# Altium schematic sheet Sheet1.SchDoc
size A2
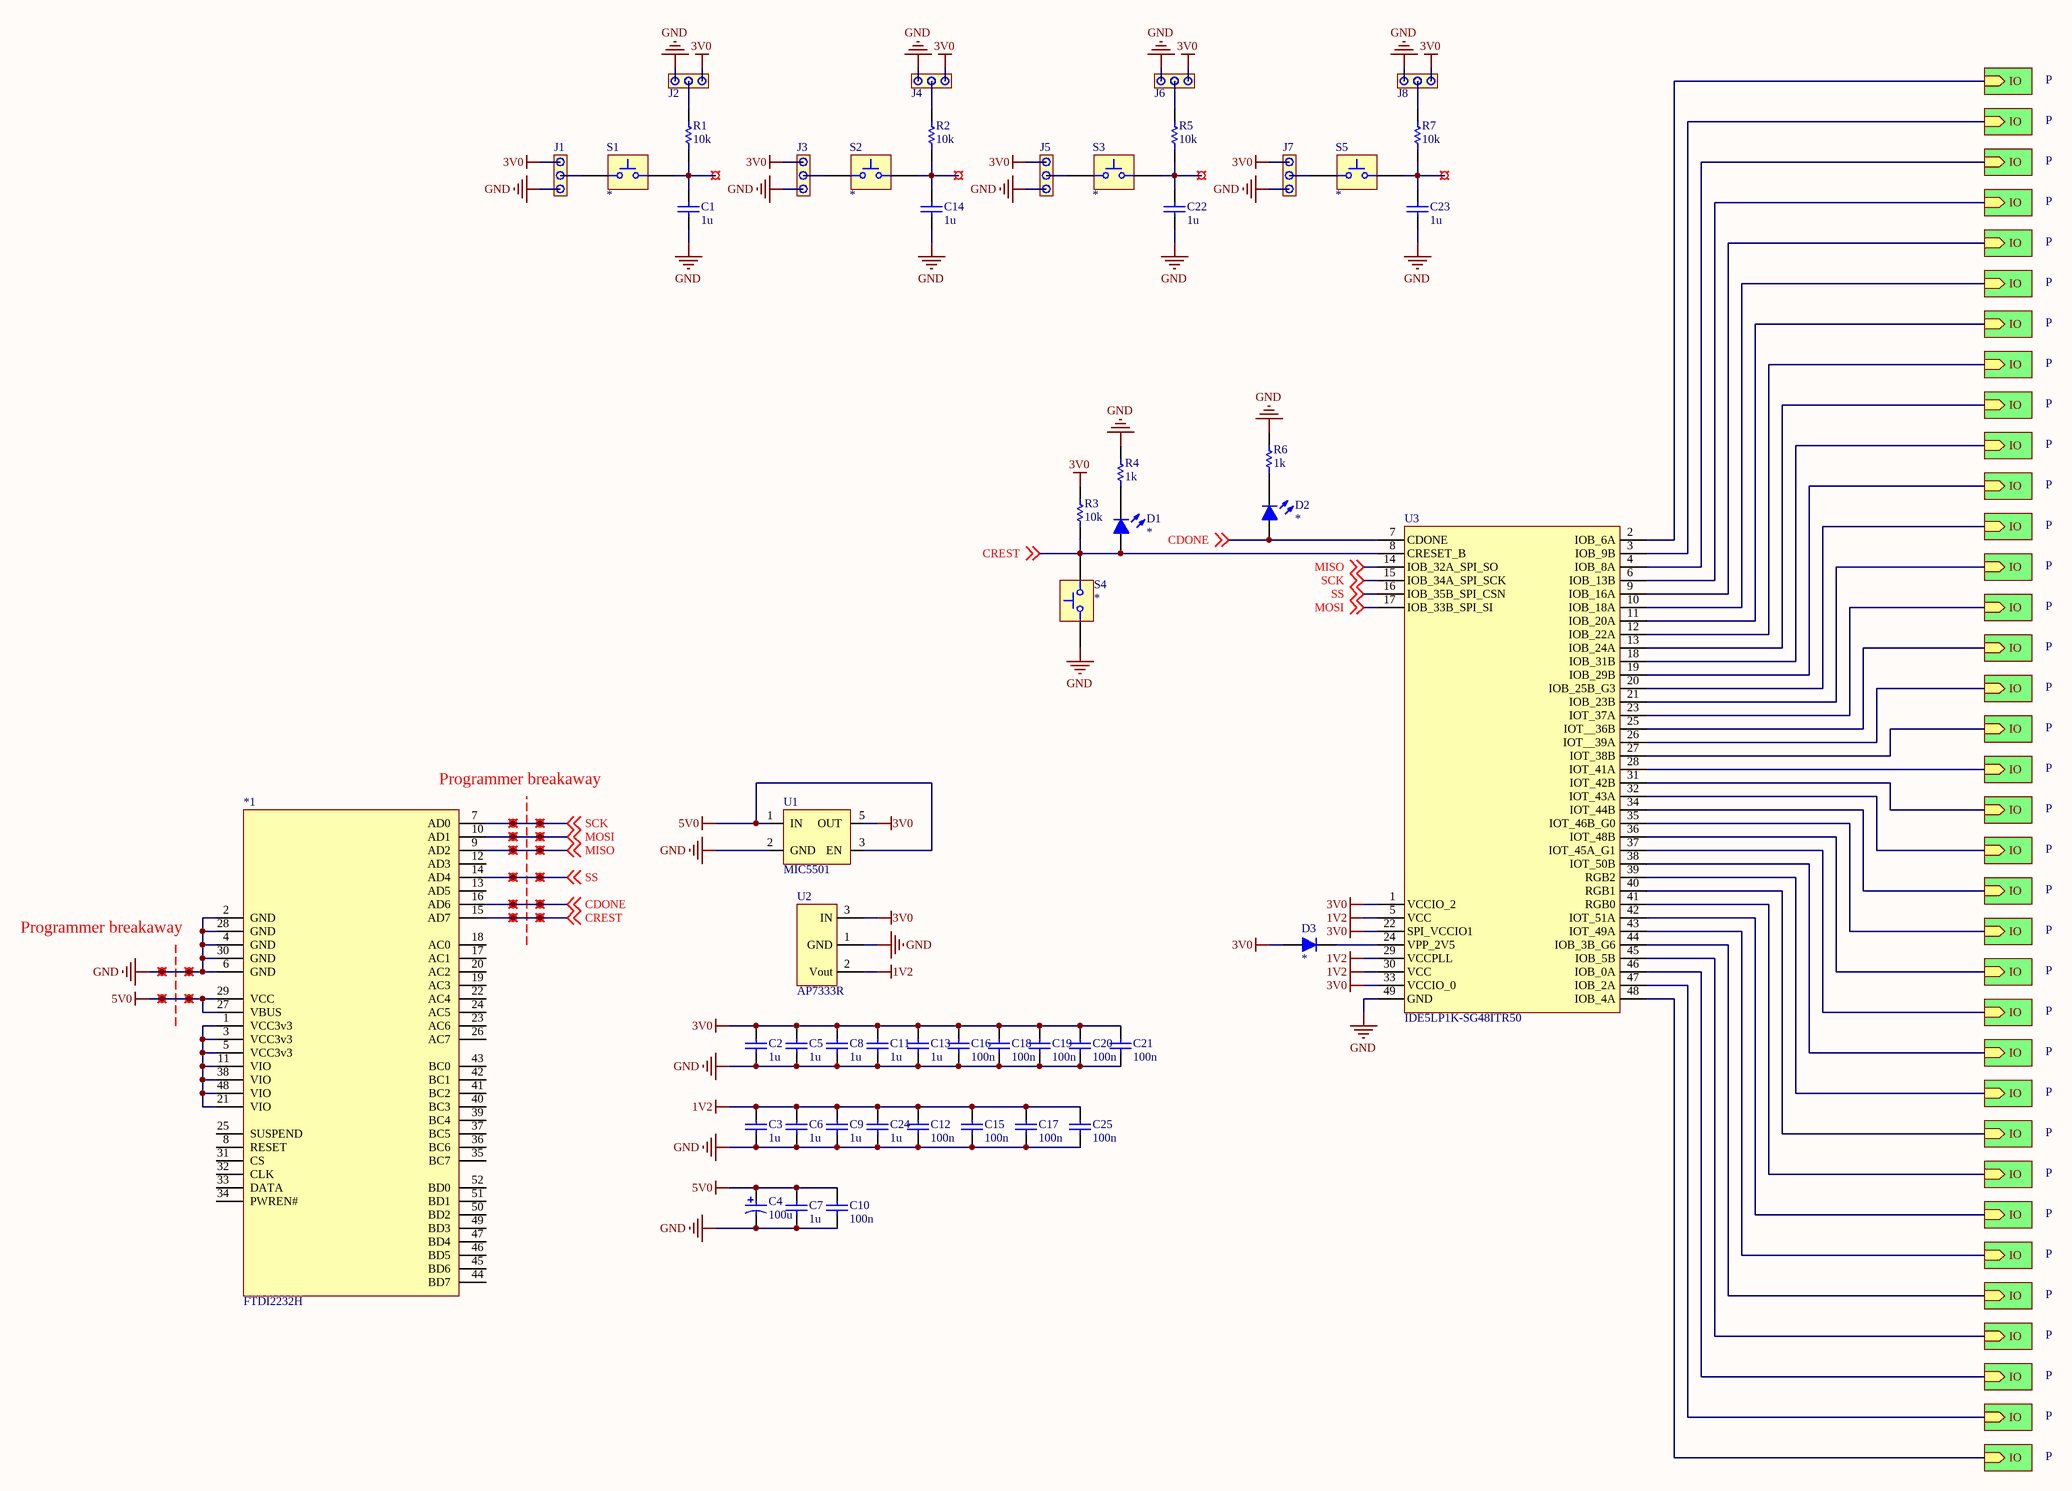
[diagram p0: Sheet1.SchDoc]

## Parts
*  Logo  [ALogo]  (value not drawn)
*1  FTDI2232H  [FTDI2232H]
C1  1u  [CAP 0805_N]
C2  1u  [CAP 0805_N]
C3  1u  [CAP 0805_N]
C4  100u  [SMD CAP-6.3X7.7MM-A1K2]
C5  1u  [CAP 0805_N]
C6  1u  [CAP 0805_N]
C7  1u  [CAP 0805_N]
C8  1u  [CAP 0805_N]
C9  1u  [CAP 0805_N]
C10  100n  [CAP 0603_N]
C11  1u  [CAP 0805_N]
C12  100n  [CAP 0603_N]
C13  1u  [CAP 0805_N]
C14  1u  [CAP 0805_N]
C15  100n  [CAP 0603_N]
C16  100n  [CAP 0603_N]
C17  100n  [CAP 0603_N]
C18  100n  [CAP 0603_N]
C19  100n  [CAP 0603_N]
C20  100n  [CAP 0603_N]
C21  100n  [CAP 0603_N]
C22  1u  [CAP 0805_N]
C23  1u  [CAP 0805_N]
C24  1u  [CAP 0805_N]
C25  100n  [CAP 0603_N]
D1  (no value)  [LED-0603-K1A2]
D2  (no value)  [LED-0603-K1A2]
D3  *  [SMA_L-K1A2]
J1  (no value)  [HDR1X3 VERT]
J2  (no value)  [HDR1X3 VERT]
J3  (no value)  [HDR1X3 VERT]
J4  (no value)  [HDR1X3 VERT]
J5  (no value)  [HDR1X3 VERT]
J6  (no value)  [HDR1X3 VERT]
J7  (no value)  [HDR1X3 VERT]
J8  (no value)  [HDR1X3 VERT]
R1  value 10k  [RES 0603_N]  (hidden comment: Res)
R2  value 10k  [RES 0603_N]  (hidden comment: Res)
R3  value 10k  [RES 0603_N]  (hidden comment: Res)
R4  value 1k  [RES 0603_N]  (hidden comment: Res)
R5  value 10k  [RES 0603_N]  (hidden comment: Res)
R6  value 1k  [RES 0603_N]  (hidden comment: Res)
R7  value 10k  [RES 0603_N]  (hidden comment: Res)
S1  SW Tactile  [SW-TACT-SMD-6035]  (value not drawn)
S2  SW Tactile  [SW-TACT-SMD-6035]  (value not drawn)
S3  SW Tactile  [SW-TACT-SMD-6035]  (value not drawn)
S4  SW Tactile  [SW-TACT-SMD-6035]  (value not drawn)
S5  SW Tactile  [SW-TACT-SMD-6035]  (value not drawn)
TP1  (no value)  [THTP]
TP2  (no value)  [THTP]
TP3  (no value)  [THTP]
TP4  (no value)  [THTP]
TP5  (no value)  [THTP]
TP6  (no value)  [THTP]
TP7  (no value)  [THTP]
TP8  (no value)  [THTP]
TP9  (no value)  [THTP]
TP10  (no value)  [THTP]
TP11  (no value)  [THTP]
TP12  (no value)  [THTP]
TP13  (no value)  [THTP]
TP14  (no value)  [THTP]
TP15  (no value)  [THTP]
TP16  (no value)  [THTP]
TP17  (no value)  [THTP]
TP26  (no value)  [THTP]
TP28  (no value)  [THTP]
TP30  (no value)  [THTP]
U1  MIC5501  [SOT23-5]
U2  AP7333R  [SOT95P245X110-3N]
U3  IDE5LP1K-SG48ITR50  [QFN50P700X700X85_HS-49M]

## Sub-sheets
P = IOpin.SchDoc: IO (in)
P = IOpin.SchDoc: IO (in)
P = IOpin.SchDoc: IO (in)
P = IOpin.SchDoc: IO (in)
P = IOpin.SchDoc: IO (in)
P = IOpin.SchDoc: IO (in)
P = IOpin.SchDoc: IO (in)
P = IOpin.SchDoc: IO (in)
P = IOpin.SchDoc: IO (in)
P = IOpin.SchDoc: IO (in)
P = IOpin.SchDoc: IO (in)
P = IOpin.SchDoc: IO (in)
P = IOpin.SchDoc: IO (in)
P = IOpin.SchDoc: IO (in)
P = IOpin.SchDoc: IO (in)
P = IOpin.SchDoc: IO (in)
P = IOpin.SchDoc: IO (in)
P = IOpin.SchDoc: IO (in)
P = IOpin.SchDoc: IO (in)
P = IOpin.SchDoc: IO (in)
P = IOpin.SchDoc: IO (in)
P = IOpin.SchDoc: IO (in)
P = IOpin.SchDoc: IO (in)
P = IOpin.SchDoc: IO (in)
P = IOpin.SchDoc: IO (in)
P = IOpin.SchDoc: IO (in)
P = IOpin.SchDoc: IO (in)
P = IOpin.SchDoc: IO (in)
P = IOpin.SchDoc: IO (in)
P = IOpin.SchDoc: IO (in)
P = IOpin.SchDoc: IO (in)
P = IOpin.SchDoc: IO (in)
P = IOpin.SchDoc: IO (in)
P = IOpin.SchDoc: IO (in)
P = IOpin.SchDoc: IO (in)

## Nets
1V2: C3.1 C6.1 C9.1 C12.1 C15.1 C17.1 C24.1 C25.1 U2.2(Vout) U3.5(VCC) U3.29(VCCPLL) U3.30(VCC)
3V0: C2.1 C5.1 C8.1 C11.1 C13.1 C16.1 C18.1 C19.1 C20.1 C21.1 D3.2(A) J1.3 J2.1 J3.3 J4.1 J5.3 J6.1 J7.3 J8.1 R3.2 U1.5(OUT) U2.3(IN) U3.1(VCCIO_2) U3.22(SPI_VCCIO1) U3.33(VCCIO_0)
5V0: *1.27(VBUS) *1.29(VCC) C4.1(A) C7.1 C10.1 TP2.1 TP4.1 U1.1(IN) U1.3(EN)
GND: *1.2(GND) *1.4(GND) *1.6(GND) *1.28(GND) *1.30(GND) C1.2 C2.2 C3.2 C4.2(K) C5.2 C6.2 C7.2 C8.2 C9.2 C10.2 C11.2 C12.2 C13.2 C14.2 C15.2 C16.2 C17.2 C18.2 C19.2 C20.2 C21.2 C22.2 C23.2 C24.2 C25.2 J1.1 J2.3 J3.1 J4.3 J5.1 J6.3 J7.1 J8.3 R4.1 R6.1 S4.1 TP1.1 TP3.1 U1.2(GND) U2.1(GND) U3.49(GND)
CDONE: *1.16(AD6) D2.2(A) TP9.1 TP15.1 U3.7(CDONE) ; off-sheet CDONE
CREST: *1.15(AD7) D1.2(A) R3.1 S4.2 TP10.1 TP16.1 U3.8(CRESET_B) ; off-sheet CREST
MISO: *1.9(AD2) TP7.1 TP13.1 U3.14(IOB_32A_SPI_SO) ; off-sheet MISO
MOSI: *1.10(AD1) TP6.1 TP12.1 U3.17(IOB_33B_SPI_SI) ; off-sheet MOSI
SCK: *1.7(AD0) TP5.1 TP11.1 U3.15(IOB_34A_SPI_SCK) ; off-sheet SCK
SS: *1.14(AD4) TP8.1 TP14.1 U3.16(IOB_35B_SPI_CSN) ; off-sheet SS
Net*1_1: *1.1(VCC3v3) *1.3(VCC3v3) *1.5(VCC3v3) *1.11(VIO) *1.21(VIO) *1.38(VIO) *1.48(VIO)
NetC1_1: C1.1 R1.1 S1.2 TP17.1
NetC14_1: C14.1 R2.1 S2.2 TP26.1
NetC22_1: C22.1 R5.1 S3.2 TP28.1
NetC23_1: C23.1 R7.1 S5.2 TP30.1
NetD1_1: D1.1(K) R4.2
NetD2_1: D2.1(K) R6.2
NetD3_1: D3.1(K) U3.24(VPP_2V5)
NetJ1_2: J1.2 S1.1
NetJ2_2: J2.2 R1.2
NetJ3_2: J3.2 S2.1
NetJ4_2: J4.2 R2.2
NetJ5_2: J5.2 S3.1
NetJ6_2: J6.2 R5.2
NetJ7_2: J7.2 S5.1
NetJ8_2: J8.2 R7.2
NetU3_2: U3.2(IOB_6A) ; sheet P/IO
NetU3_3: U3.3(IOB_9B) ; sheet P/IO
NetU3_4: U3.4(IOB_8A) ; sheet P/IO
NetU3_6: U3.6(IOB_13B) ; sheet P/IO
NetU3_9: U3.9(IOB_16A) ; sheet P/IO
NetU3_10: U3.10(IOB_18A) ; sheet P/IO
NetU3_11: U3.11(IOB_20A) ; sheet P/IO
NetU3_12: U3.12(IOB_22A) ; sheet P/IO
NetU3_13: U3.13(IOB_24A) ; sheet P/IO
NetU3_18: U3.18(IOB_31B) ; sheet P/IO
NetU3_19: U3.19(IOB_29B) ; sheet P/IO
NetU3_20: U3.20(IOB_25B_G3) ; sheet P/IO
NetU3_21: U3.21(IOB_23B) ; sheet P/IO
NetU3_23: U3.23(IOT_37A) ; sheet P/IO
NetU3_25: U3.25(IOT__36B) ; sheet P/IO
NetU3_26: U3.26(IOT__39A) ; sheet P/IO
NetU3_27: U3.27(IOT_38B) ; sheet P/IO
NetU3_28: U3.28(IOT_41A) ; sheet P/IO
NetU3_31: U3.31(IOT_42B) ; sheet P/IO
NetU3_32: U3.32(IOT_43A) ; sheet P/IO
NetU3_34: U3.34(IOT_44B) ; sheet P/IO
NetU3_35: U3.35(IOT_46B_G0) ; sheet P/IO
NetU3_36: U3.36(IOT_48B) ; sheet P/IO
NetU3_37: U3.37(IOT_45A_G1) ; sheet P/IO
NetU3_38: U3.38(IOT_50B) ; sheet P/IO
NetU3_39: U3.39(RGB2) ; sheet P/IO
NetU3_40: U3.40(RGB1) ; sheet P/IO
NetU3_41: U3.41(RGB0) ; sheet P/IO
NetU3_42: U3.42(IOT_51A) ; sheet P/IO
NetU3_43: U3.43(IOT_49A) ; sheet P/IO
NetU3_44: U3.44(IOB_3B_G6) ; sheet P/IO
NetU3_45: U3.45(IOB_5B) ; sheet P/IO
NetU3_46: U3.46(IOB_0A) ; sheet P/IO
NetU3_47: U3.47(IOB_2A) ; sheet P/IO
NetU3_48: U3.48(IOB_4A) ; sheet P/IO

Not connected (* = marked no-connect by the designer): *1 8(RESET) 12(AD3) 13(AD5) 17(AC1) 18(AC0) 19(AC3) 20(AC2) 22(AC4) 23(AC6) 24(AC5) 25(SUSPEND) 26(AC7) 31(CS) 32(CLK) 33(DATA) 34(PWREN#) 35(BC7) 36(BC6) 37(BC5) 39(BC4) 40(BC3) 41(BC2) 42(BC1) 43(BC0) 44(BD7) 45(BD6) 46(BD5) 47(BD4) 49(BD3) 50(BD2) 51(BD1) 52(BD0)

## Notes on the sheet
- Programmer breakaway
- Revision:
- Title:

## Library data of the parts
C1-C3 C5-C25 = -Cap Non-Pol: CAP, CER; Voltage: *
  C1-C3 C5-C9 C11 C13 C14 C22-C24: Value: 1u
  C10 C12 C15-C21 C25: Value: 100n
C4 = -Cap Aluminum: CAP, ALUM, A1K2; Voltage: *; ESR: *; Value: 100u
D1 D2 = -LED K1A2: 2 Pin LED K1A2; Label: *
D3 = -Diode K1A2: 2 Pin Diode K1A2; Value: *
J1-J8 = Header 1-3: Header, 3 Pin, 1.27mm Pitch, Vertical
R1-R7 = Res: Resistor; Published: 8-Jun-2000; LatestRevisionDate: 17-Jul-2002; LatestRevisionNote: Re-released for DXP Platform.; PackageReference: AXIAL-0.3; Publisher: Altium Limited; PackageDescription: Axial Device, Thru-Hole; 2 Leads; 0.3 in Pin Spacing
S1-S5 = SW-NO (PTS635SH43SMTRLFS): SPST, Normally Open, Push Button; Value: PTS635SH43SMTRLFS; Supplier 1: Mouser; Supplier Part Number 1: 611-PTS635SH43SMTRLF; Label: *
TP1-TP17 TP26 TP28 TP30 = THTP
U1 = LP5907: Value: *